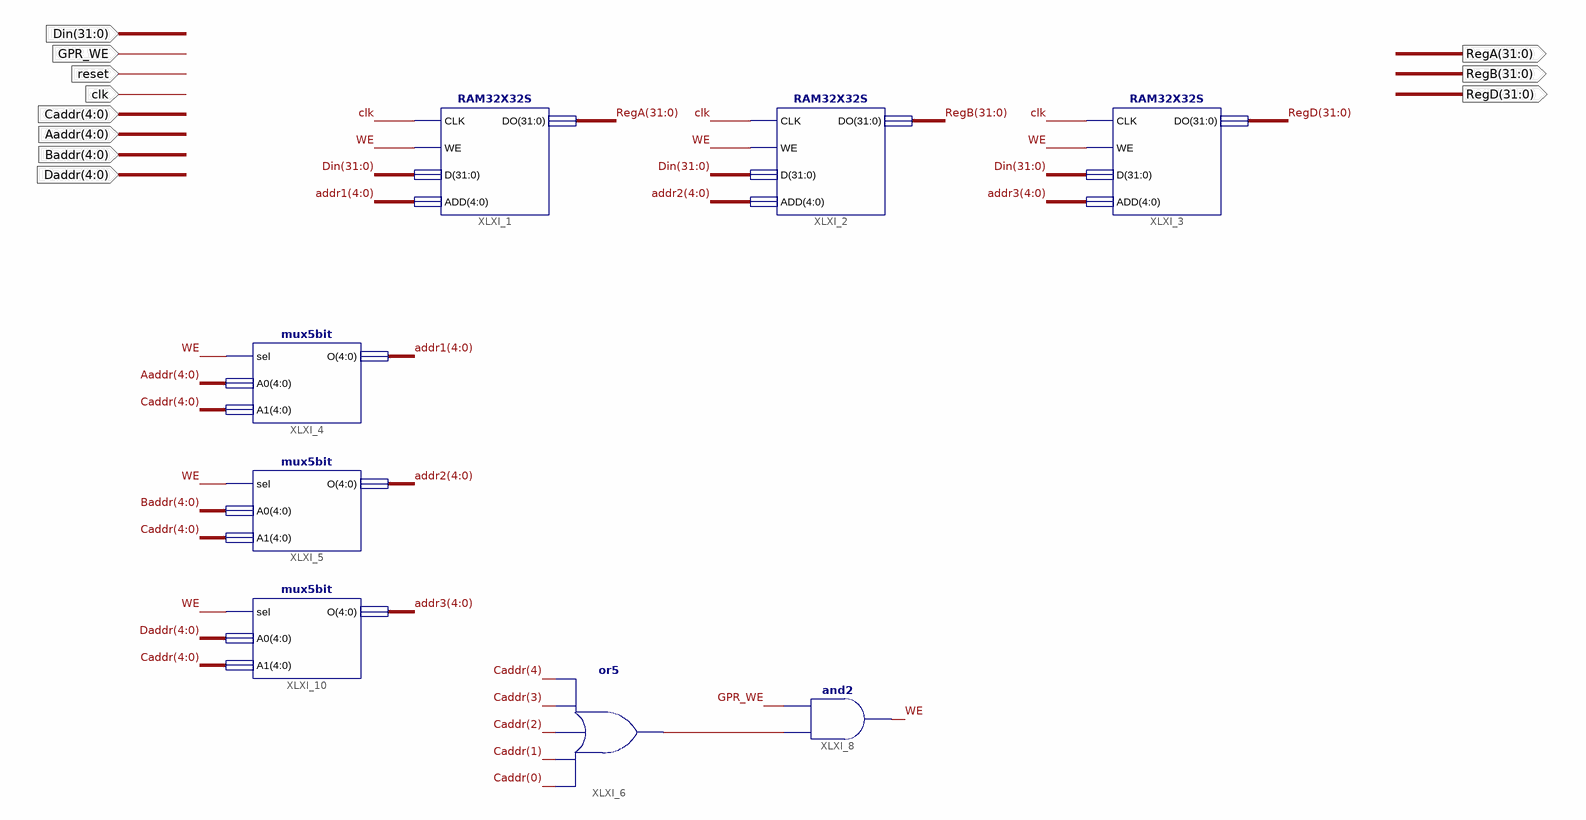
[diagram p0: schematic sheet 1]
// Xilinx ISE schematic GPR.sch (spartan6) as structural Verilog: 8 symbols, 11 ports
module GPR (
  input  GPR_WE,
  input  [31:0] Din,
  input  reset,
  input  clk,
  input  [4:0] Caddr,
  input  [4:0] Aaddr,
  input  [4:0] Baddr,
  input  [4:0] Daddr,
  output [31:0] RegA,
  output [31:0] RegB,
  output [31:0] RegD
);

  wire WE, XLXN_34;
  wire [4:0] addr1, addr2, addr3;

  RAM32X32S XLXI_1 (.CLK(clk), .WE(WE), .D(Din), .ADD(addr1), .DO(RegA));
  RAM32X32S XLXI_2 (.CLK(clk), .WE(WE), .D(Din), .ADD(addr2), .DO(RegB));
  mux5bit XLXI_4 (.sel(WE), .A0(Aaddr), .A1(Caddr), .O(addr1));
  mux5bit XLXI_5 (.sel(WE), .A0(Baddr), .A1(Caddr), .O(addr2));
  or XLXI_6 (XLXN_34, Caddr[0], Caddr[1], Caddr[2], Caddr[3], Caddr[4]);
  and XLXI_8 (WE, XLXN_34, GPR_WE);
  mux5bit XLXI_10 (.sel(WE), .A0(Daddr), .A1(Caddr), .O(addr3));
  RAM32X32S XLXI_3 (.CLK(clk), .WE(WE), .D(Din), .ADD(addr3), .DO(RegD));
endmodule
